# Altium schematic sheet Sheet5.SchDoc
size A3; Organization: Altium Limited; Address1: L3, 12a Rodborough Rd; Address2: Frenchs Forest; Address3: NSW; Address4: Australia 2086
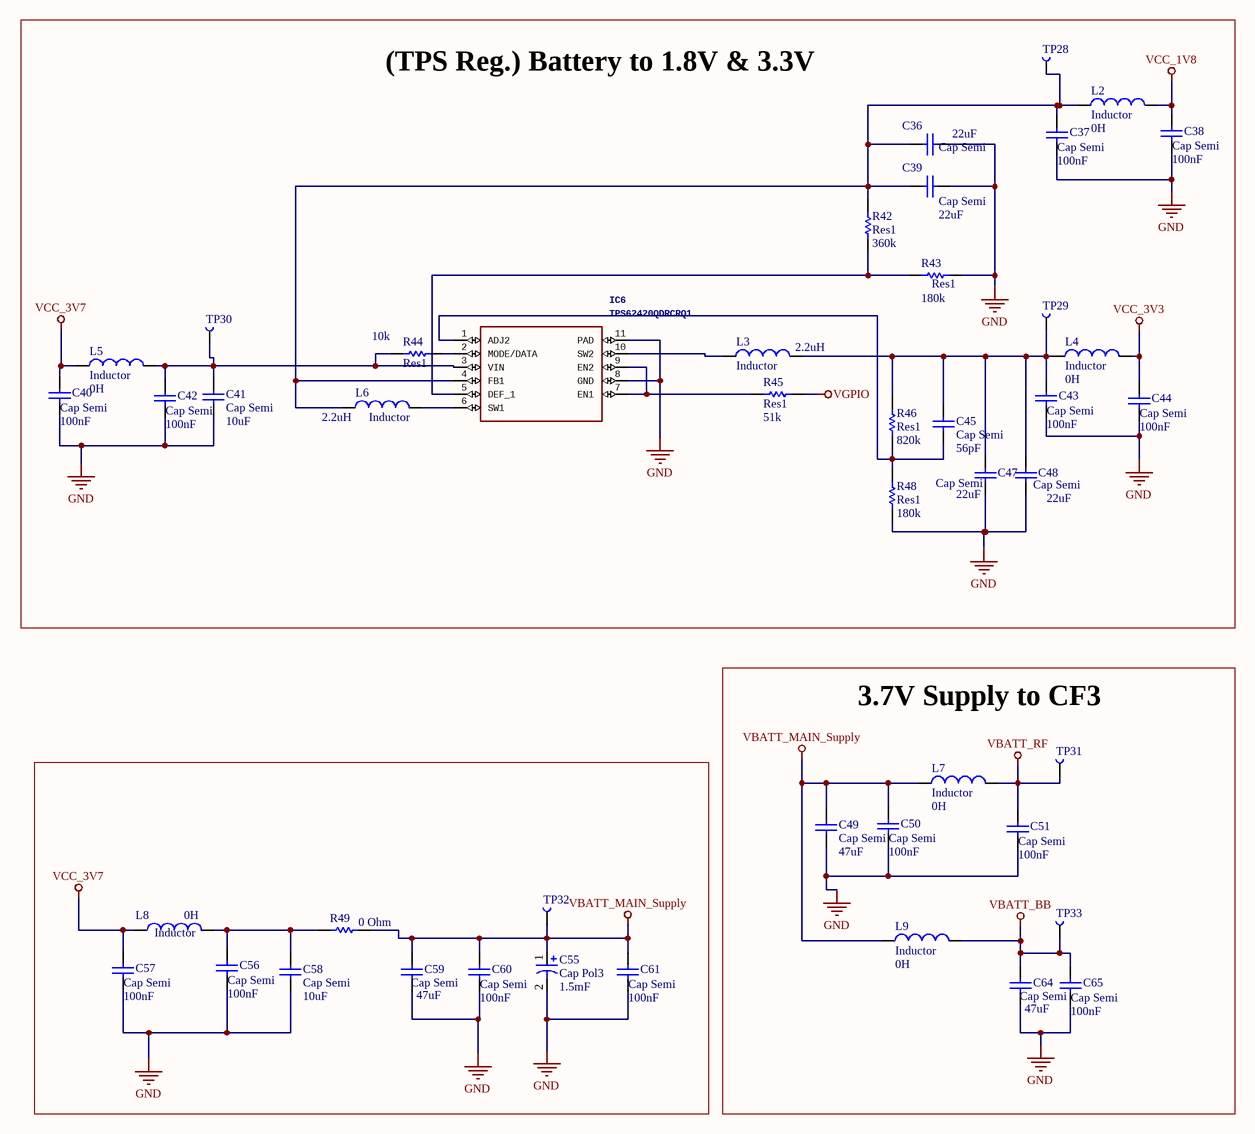
[diagram p0: Sheet5.SchDoc]

## Parts
C36  Cap Semi  value 22uF  [CAP 0603/1608]
C37  Cap Semi  value 100nF  [CAP 0402/1005]
C38  Cap Semi  value 100nF  [CAP 0402/1005]
C39  Cap Semi  value 22uF  [CAP 0603/1608]
C40  Cap Semi  value 100nF  [CAP 0402/1005]
C41  Cap Semi  value 10uF  [CAP 0805/2012]
C42  Cap Semi  value 100nF  [CAP 0402/1005]
C43  Cap Semi  value 100nF  [CAP 0402/1005]
C44  Cap Semi  value 100nF  [CAP 0402/1005]
C45  Cap Semi  value 56pF  [CAP 0402/1005]
C47  Cap Semi  value 22uF  [CAP 0603/1608]
C48  Cap Semi  value 22uF  [CAP 0603/1608]
C49  Cap Semi  value 47uF  [CAP 1206/3216]
C50  Cap Semi  value 100nF  [CAP 0402/1005]
C51  Cap Semi  value 100nF  [CAP 0402/1005]
C55  Cap Pol3  value 1.5mF  [F720J158MMC]
C56  Cap Semi  value 100nF  [CAP 0402/1005]
C57  Cap Semi  value 100nF  [CAP 0402/1005]
C58  Cap Semi  value 10uF  [CAP 0603/1608]
C59  Cap Semi  value 47uF  [CAP 1206/3216]
C60  Cap Semi  value 100nF  [CAP 0402/1005]
C61  Cap Semi  value 100nF  [CAP 0402/1005]
C64  Cap Semi  value 47uF  [CAP 1206/3216]
C65  Cap Semi  value 100nF  [CAP 0402/1005]
IC6  TPS62420QDRCRQ1  [SON50P300X300X100-11N - 3D]
L2  Inductor  value 0H  [INDC1608L]
L3  Inductor  value 2.2uH  [0402-A]
L4  Inductor  value 0H  [INDC1608L]
L5  Inductor  value 0H  [INDC1608L]
L6  Inductor  value 2.2uH  [0402-A]
L7  Inductor  value 0H  [INDC1608L]
L8  Inductor  value 0H  [INDC1608L]
L9  Inductor  value 0H  [INDC1608L]
R42  Res1  value 360k  [RES 0402/1005]
R43  Res1  value 180k  [RES 0402/1005]
R44  Res1  value 10k  [RES 0402/1005]
R45  Res1  value 51k  [RES 0402/1005]
R46  Res1  value 820k  [RES 0402/1005]
R48  Res1  value 180k  [RES 0402/1005]
R49  value 0 Ohm  [RES 0402/1005]  (hidden comment: Res1)
TP28  TestPoint  [TestPoint]  (value not drawn)
TP29  TestPoint  [TestPoint]  (value not drawn)
TP30  TestPoint  [TestPoint]  (value not drawn)
TP31  TestPoint  [TestPoint]  (value not drawn)
TP32  TestPoint  [TestPoint]  (value not drawn)
TP33  TestPoint  [TestPoint]  (value not drawn)

## Blocks framed on the sheet
(TPS Reg.) Battery to 1.8V & 3.3V: C36-C45 C47 C48 IC6 L2-L6 R42-R46 R48 TP28-TP30
3.7V Supply to CF3: C49-C51 C64 C65 L7 L9 TP31 TP33

## Nets
GND: C36.1 C37.1 C38.1 C39.1 C40.1 C41.1 C42.1 C43.1 C44.1 C47.1 C48.1 C49.1 C50.1 C51.1 C55.2 C56.1 C57.1 C58.1 C59.1 C60.1 C61.1 C64.1 C65.1 IC6.8(GND) IC6.11(PAD) R43.1 R48.1
VBATT_BB: C64.2 C65.2 L9.2 TP33.1(TP)
VBATT_MAIN_Supply: C49.2 C50.2 C55.1 C59.2 C60.2 C61.2 L7.1 L9.1 R49.2 TP32.1(TP)
VBATT_RF: C51.2 L7.2 TP31.1(TP)
VCC_1V8: C38.2 L2.2
VCC_3V3: C44.2 L4.2
VCC_3V7: C40.2 C57.2 L5.1 L8.1
VGPIO: R45.2
NetC36_2: C36.2 C37.2 C39.2 IC6.4(FB1) L2.1 L6.1 R42.1 TP28.1(TP)
NetC41_2: C41.2 C42.2 IC6.3(VIN) L5.2 R44.1 TP30.1(TP)
NetC43_2: C43.2 C45.2 C47.2 C48.2 L3.2 L4.1 R46.2 TP29.1(TP)
NetC45_1: C45.1 IC6.1(ADJ2) R46.1 R48.2
NetC56_2: C56.2 C58.2 L8.2 R49.1
NetIC6_2: IC6.2(MODE/DATA) R44.2
NetIC6_5: IC6.5(DEF_1) R42.2 R43.2
NetIC6_6: IC6.6(SW1) L6.2
NetIC6_7: IC6.7(EN1) IC6.9(EN2) R45.1
NetIC6_10: IC6.10(SW2) L3.1

## Notes on the sheet
- Title
- Size:
- Date:
- A3
- Number:
- Time:
- Revision:
- Sheet
- of
- File:

## Library data of the parts
C36 C39 C47 C48 = Cap Semi: 22µF ±20% 6.3V Ceramic Capacitor X5R 0603 (1608 Metric); Part Number: GRM188R60J226MEA0D; LatestRevisionDate: 29-May-2009; LatestRevisionNote: IPC-7351 Footprint Added.; PackageReference: C1206; Publisher: Altium Limited; PackageDescription: Chip Capacitor; Supplier Link: https://www.digikey.com/product-detail/en/murata-electronics-north-america/GRM188R60J226MEA0D/490-7611-1-ND/4280544
C37 C38 C43 C44 C50 C51 C60 C61 C65 = Cap Semi: 0.1µF ±10% 10V Ceramic Capacitor X5R 0402 (1005 Metric); Part Number: LMK105BJ104KV-F; Published: 8-Jun-2000; LatestRevisionDate: 29-May-2009; LatestRevisionNote: IPC-7351 Footprint Added.; PackageReference: C1206; PackageDescription: Chip Capacitor; Supplier Link: https://www.digikey.com/product-detail/en/taiyo-yuden/LMK105BJ104KV-F/587-1227-1-ND/931004
C40 C42 C56 C57 = Cap Semi: 0.1µF -20%, +80% 16V Ceramic Capacitor Y5V (F) 0402 (1005 Metric); Part Number: VJ0402V104ZXJCW1BC; Published: 8-Jun-2000; LatestRevisionDate: 29-May-2009; LatestRevisionNote: IPC-7351 Footprint Added.; PackageReference: C1206; PackageDescription: Chip Capacitor; Supplier Link: https://www.digikey.com/product-detail/en/vishay-vitramon/VJ0402V104ZXJCW1BC/720-1523-1-ND/420979
C41 = Cap Semi: 10µF ±10% 10V Ceramic Capacitor X5R 0805 (2012 Metric); Part Number: LMK212BJ106KG-T; LatestRevisionDate: 29-May-2009; LatestRevisionNote: IPC-7351 Footprint Added.; PackageReference: C1206; Publisher: Altium Limited; PackageDescription: Chip Capacitor; Supplier Link: https://www.digikey.com/product-detail/en/taiyo-yuden/LMK212BJ106KG-T/587-1300-1-ND/931077
C45 = Cap Semi: 56pF ±5% 50V Ceramic Capacitor C0G, NP0 0402 (1005 Metric); Part Number: UMK105CG560JV-F; LatestRevisionDate: 29-May-2009; LatestRevisionNote: IPC-7351 Footprint Added.; PackageReference: C1206; Publisher: Altium Limited; PackageDescription: Chip Capacitor; Supplier Link: https://www.digikey.com/product-detail/en/taiyo-yuden/UMK105CG560JV-F/587-1208-1-ND/930985
C49 C59 C64 = Cap Semi: 47µF ±20% 10V Ceramic Capacitor X5R 1206 (3216 Metric); Part Number: LMK316BJ476ML-T; LatestRevisionDate: 29-May-2009; LatestRevisionNote: IPC-7351 Footprint Added.; PackageReference: C1206; Publisher: Altium Limited; PackageDescription: Chip Capacitor; Supplier Link: https://www.digikey.com/product-detail/en/taiyo-yuden/LMK316BJ476ML-T/587-1780-1-ND/1212796
C55 = Cap Pol3: 1500µF Conformal Coated Tantalum Capacitors 6.3V 2824 (7260 Metric) 140 mOhm; Available: 0; Published: 8-Jun-2000; LatestRevisionDate: 29-May-2009; LatestRevisionNote: IPC-7351 Footprint Added.; PackageReference: C0805; Publisher: Altium Limited; PackageDescription: Chip Capacitor; Part Number: F720J158MMC; Supplier Link: https://www.digikey.com/product-detail/en/avx-corporation/F720J158MMC/478-8067-1-ND/4005932
C58 = Cap Semi: 10µF ±20% 10V Ceramic Capacitor X5R 0603 (1608 Metric); Part Number: GRM188R61A106ME69D; LatestRevisionDate: 29-May-2009; LatestRevisionNote: IPC-7351 Footprint Added.; PackageReference: C1206; Publisher: Altium Limited; PackageDescription: Chip Capacitor; Supplier Link: https://www.digikey.com/product-detail/en/murata-electronics-north-america/GRM188R61A106ME69D/490-10475-1-ND/5026393
IC6 = TPS62420QDRCRQ1: Buck Switching Regulator IC Positive Adjustable 0.6V 2 Output 600mA, 1A 10-VFDFN Exposed Pad; Manufacturer_Name: Texas Instruments; Part Number: TPS62420DRCR; GateName_1: G$1; SymbolName_1: TPS62420QDRCRQ1; LibraryName: TPS62420QDRCRQ1; DeviceSetName: TPS62420QDRCRQ1; Package: SON50P300X300X100-11N; Manufacturer_Part_Number: TPS62420QDRCRQ1; Mouser_Price-Stock: https://www.mouser.com/Search/Refine.aspx?Keyword=595-TPS62420QDRCRQ1; Height: mm; Supplier Link: https://www.digikey.com/product-detail/en/texas-instruments/TPS62420DRCR/296-25650-1-ND/2203742
L2 L4 L5 = Inductor: 220 Ohms @ 100MHz 1 Power Line Ferrite Bead 0603 (1608 Metric) 2.2A 50 mOhm; Part Number: MPZ1608S221ATA00; Code_IEC: 1005; Published: 8-Jun-2000; LatestRevisionDate: 29-May-2009; LatestRevisionNote: IPC-7351 Footprint Added.; PackageReference: 0402-A; Publisher: Altium Limited; PackageDescription: Chip Inductor; Code_JEITA: 0402; Supplier Link: https://www.digikey.com/product-detail/en/tdk-corporation/MPZ1608S221ATA00/445-1565-1-ND/571895
L3 L6 = Inductor: Part Number: MIPF2016D2R2; Code_IEC: 1005; Published: 8-Jun-2000; LatestRevisionDate: 29-May-2009; LatestRevisionNote: IPC-7351 Footprint Added.; PackageReference: 0402-A; Publisher: Altium Limited; PackageDescription: Chip Inductor; Code_JEITA: 0402
  L6: Supplier Link: *
L7-L9 = Inductor: 120 Ohms @ 100MHz 1 Power Line Ferrite Bead 0603 (1608 Metric) 2.7A 35 mOhm; Part Number: BKP1608HS121-T; Code_IEC: 1005; Published: 8-Jun-2000; LatestRevisionDate: 29-May-2009; LatestRevisionNote: IPC-7351 Footprint Added.; PackageReference: 0402-A; Publisher: Altium Limited; PackageDescription: Chip Inductor; Code_JEITA: 0402; Supplier Link: https://www.digikey.com/product-detail/en/taiyo-yuden/BKP1608HS121-T/587-1923-1-ND/1465393
R42 = Res1: 360 kOhms ±1% 0.063W, 1/16W Chip Resistor 0402 (1005 Metric) Automotive AEC-Q200 Thick Film; Part Number: MCR01MZPF3603; Available: 0; Published: 8-Jun-2000; LatestRevisionDate: 17-Jul-2002; LatestRevisionNote: Re-released for DXP Platform.; PackageReference: AXIAL-0.3; PackageDescription: Axial Device, Thru-Hole; 2 Leads; 0.3 in Pin Spacing; Supplier Link: https://www.digikey.com/product-detail/en/rohm-semiconductor/MCR01MZPF3603/RHM360KLCT-ND/628144; Supplier Link 2: https://www.digikey.com/product-detail/en/yageo/AC0402FR-07360KL/311-360KLBCT-ND/2828125; Part Number 2: AC0402FR-07360KL
R43 R48 = Res1: 180 kOhms ±1% 0.1W, 1/10W Chip Resistor 0402 (1005 Metric) Automotive AEC-Q200 Thick Film; Part Number: RK73H1ETTP1803F; Published: 8-Jun-2000; LatestRevisionDate: 17-Jul-2002; LatestRevisionNote: Re-released for DXP Platform.; PackageReference: AXIAL-0.3; PackageDescription: Axial Device, Thru-Hole; 2 Leads; 0.3 in Pin Spacing; Supplier Link: https://www.digikey.com/product-detail/en/koa-speer-electronics-inc/RK73H1ETTP1803F/2019-RK73H1ETTP1803FCT-ND/9846242
R44 = Res1: 10 kOhms ±5% 0.063W, 1/16W Chip Resistor 0402 (1005 Metric) Automotive AEC-Q200 Thick Film; Part Number: MCR01MZPJ103; Available: 0; Published: 8-Jun-2000; LatestRevisionDate: 17-Jul-2002; LatestRevisionNote: Re-released for DXP Platform.; PackageReference: AXIAL-0.3; PackageDescription: Axial Device, Thru-Hole; 2 Leads; 0.3 in Pin Spacing; Supplier Link: https://www.digikey.com/product-detail/en/rohm-semiconductor/MCR01MZPJ103/RHM10KJCT-ND/628226; Supplier Link 2: https://www.digikey.fi/product-detail/en/vishay-dale/CRCW040210K0JNED/541-10KJCT-ND/1182708?cur=USD&lang=en; Part Number 2: CRCW040210K0JNED
R45 = Res1: 51 kOhms ±5% 0.063W, 1/16W Chip Resistor 0402 (1005 Metric); Part Number: MCR01MZPJ513; Published: 8-Jun-2000; LatestRevisionDate: 17-Jul-2002; LatestRevisionNote: Re-released for DXP Platform.; PackageReference: AXIAL-0.3; PackageDescription: Axial Device, Thru-Hole; 2 Leads; 0.3 in Pin Spacing; Supplier Link: https://www.verical.com/pd/rohm-semiconductor-fixed-single---surface-mount-MCR01MZPJ513-450205?utm_campaign=octopart_2018&utm_currency=USD&utm_keyword=MCR01MZPJ513&utm_medium=aggregator&utm_content=inv_listing&utm_source=octopart; Supplier Link 2: https://www.digikey.ee/product-detail/en/bourns-inc/CR0402-JW-513GLF/CR0402-JW-513GLFCT-ND/8604290; Part Number 2: CR0402-JW-513GLF
R46 = Res1: 820 kOhms ±1% 0.063W, 1/16W Chip Resistor 0402 (1005 Metric) Moisture Resistant Thick Film; Part Number: RC0402FR-07820KL; Published: 8-Jun-2000; LatestRevisionDate: 17-Jul-2002; LatestRevisionNote: Re-released for DXP Platform.; PackageReference: AXIAL-0.3; PackageDescription: Axial Device, Thru-Hole; 2 Leads; 0.3 in Pin Spacing; Supplier Link: https://www.digikey.com/product-detail/en/yageo/RC0402FR-07820KL/YAG3240CT-ND/5282105
R49 = Res1: 0 Ohms Jumper  Chip Resistor 0402 (1005 Metric) Automotive AEC-Q200 Metal Element; Part Number: RK73Z1ETTP; Published: 8-Jun-2000; LatestRevisionDate: 17-Jul-2002; LatestRevisionNote: Re-released for DXP Platform.; PackageReference: AXIAL-0.3; PackageDescription: Axial Device, Thru-Hole; 2 Leads; 0.3 in Pin Spacing; Supplier Link: https://www.digikey.com/product-detail/en/koa-speer-electronics-inc/RK73Z1ETTP/2019-RK73Z1ETTPCT-ND/9846740